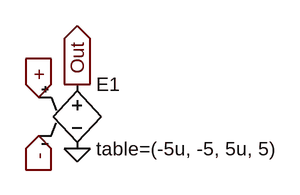
[diagram p0: schematic IdealOpAmp.asc]
IdealOpAmp.asc, the LTspice schematic file:
Version 4
SHEET 1 880 680
FLAG 208 192 0
FLAG 160 128 +
IOPIN 160 128 In
FLAG 160 176 -
IOPIN 160 176 In
FLAG 208 112 Out
IOPIN 208 112 Out
SYMBOL e 208 96 R0
SYMATTR InstName E1
SYMATTR Value table=(-5u, -5, 5u, 5)

The netlist it stands for:
* IdealOpAmp.asc
E1 Out 0 + - table=(-5u, -5, 5u, 5)
.backanno
.end